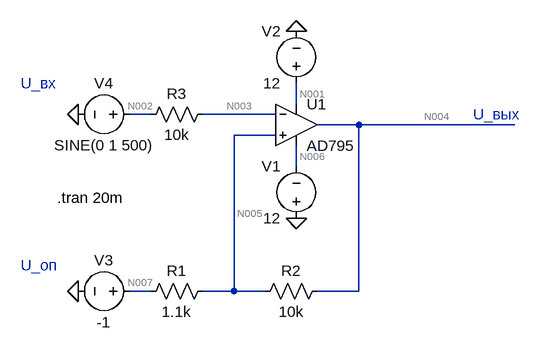
[diagram p0: schematic task32.asc]
task32.asc, the LTspice schematic file:
Version 4.1
SHEET 1 880 680
WIRE 192 144 192 112
WIRE -32 160 -64 160
WIRE 160 160 48 160
WIRE 288 176 224 176
WIRE 528 176 288 176
WIRE 160 192 96 192
WIRE 192 240 192 208
WIRE -32 432 -64 432
WIRE 96 432 96 192
WIRE 96 432 48 432
WIRE 144 432 96 432
WIRE 288 432 288 176
WIRE 288 432 224 432
FLAG 192 32 0
FLAG 192 320 0
FLAG -144 432 0
FLAG -144 160 0
SYMBOL voltage 192 336 R180
WINDOW 0 24 96 Left 2
WINDOW 3 24 16 Left 2
SYMATTR InstName V1
SYMATTR Value 12
SYMBOL voltage 192 128 R180
WINDOW 0 24 96 Left 2
WINDOW 3 24 16 Left 2
SYMATTR InstName V2
SYMATTR Value 12
SYMBOL res 64 416 R90
WINDOW 0 0 56 VBottom 2
WINDOW 3 32 56 VTop 2
SYMATTR InstName R1
SYMATTR Value 1.1k
SYMBOL res 240 416 R90
WINDOW 0 0 56 VBottom 2
WINDOW 3 32 56 VTop 2
SYMATTR InstName R2
SYMATTR Value 10k
SYMBOL voltage -48 432 R90
WINDOW 0 -32 56 VBottom 2
WINDOW 3 32 56 VTop 2
SYMATTR InstName V3
SYMATTR Value -1
SYMBOL voltage -48 160 R90
WINDOW 0 -32 56 VBottom 2
WINDOW 3 32 56 VTop 2
WINDOW 123 0 0 Left 0
WINDOW 39 0 0 Left 0
SYMATTR InstName V4
SYMATTR Value SINE(0 1 500)
SYMBOL res 64 144 R90
WINDOW 0 0 56 VBottom 2
WINDOW 3 32 56 VTop 2
SYMATTR InstName R3
SYMATTR Value 10k
SYMBOL OpAmps\\AD795 192 112 R0
SYMATTR InstName U1
TEXT -232 392 Left 2 ;U_оп
TEXT 464 160 Left 2 ;U_вых
TEXT -232 112 Left 2 ;U_вх
TEXT -176 288 Left 2 !.tran 20m

The netlist it stands for:
* task32.asc
V1 0 N006 12
V2 N001 0 12
R1 N005 N007 1.1k
R2 N004 N005 10k
V3 N007 0 -1
V4 N002 0 SINE(0 1 500)
R3 N003 N002 10k
X§U1 N005 N003 N001 N006 N004 AD795  ; pins In+ In- V+ V- OUT
* U_оп
* U_вых
* U_вх
.tran 20m
.lib ADI1.lib
.backanno
.end

* Results of the author's LTspice run, read from the files saved beside the schematic
* Operating Point, zero values left out:
*   V(n001) = 12 V
*   V(n004) = 9.091 V
*   V(n005) = 478.2 nV
*   V(n006) = -12 V
*   V(n007) = -1 V
*   I(R1) = 909.1 µA
*   I(R2) = 909.1 µA
*   I(V1) = -2.251 mA
*   I(V2) = -3.16 mA
*   I(V3) = 909.1 µA
*   Ix(u1:3) = 3.16 mA
*   Ix(u1:4) = -2.251 mA
*   Ix(u1:5) = -909.1 µA
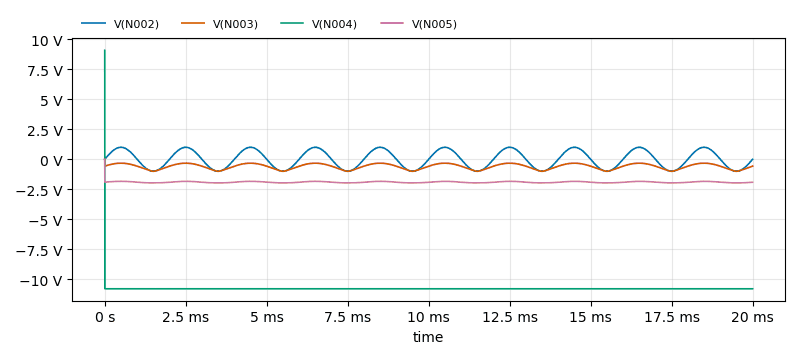
[diagram p1: Transient Analysis of task32.asc, plotted from the saved traces]
* Transient Analysis, 1 run:
*   V(N002): min -1 V, max 1 V, average 0 V, rms 707.1 mV, last 0 V
*   V(N003): min -1 V, max 343.4 µV, average -611.1 mV, rms 651.4 mV, last -575.8 mV
*   V(N004): min -10.81 V, max 9.091 V, average -10.81 V, rms 10.81 V, last -10.81 V
*   V(N005): min -1.972 V, max 1.738 µV, average -1.912 V, rms 1.912 V, last -1.915 V